# Altium schematic sheet carrier_card.SchDoc: Swarmbot Connectors
size A4; DrawnBy: Thomas Christensen; Revision: 2; SheetNumber: 1; SheetTotal: 3
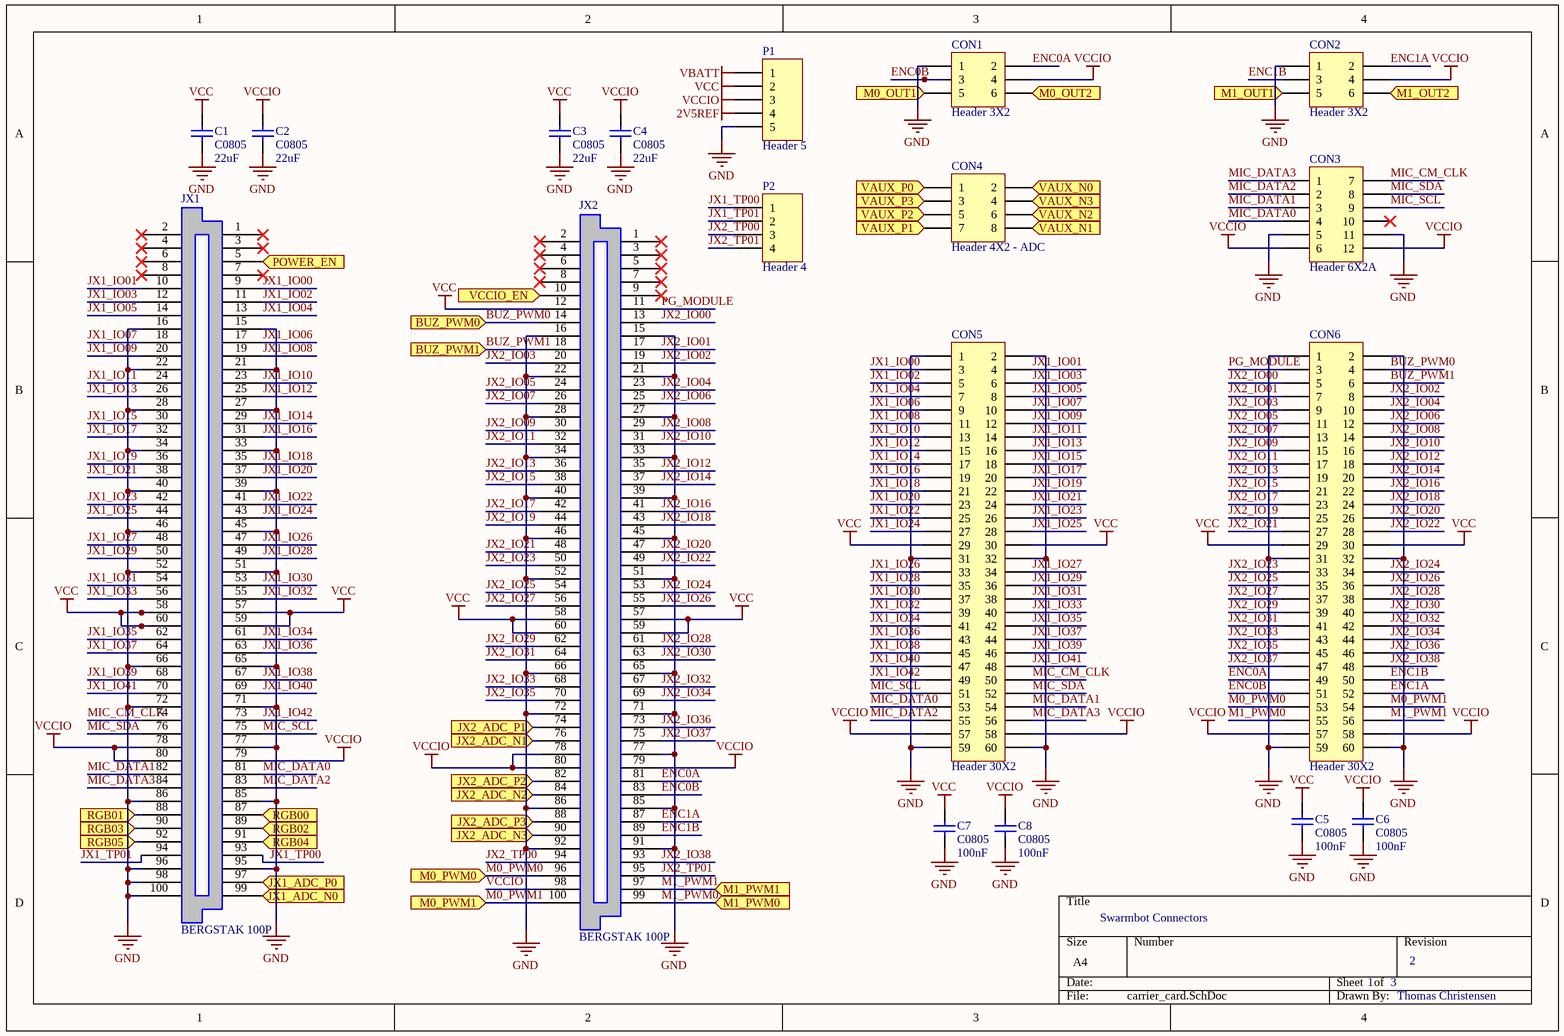
[diagram p0: carrier_card.SchDoc]

## Parts
C1  C0805  value 22uF  [0805]
C2  C0805  value 22uF  [0805]
C3  C0805  value 22uF  [0805]
C4  C0805  value 22uF  [0805]
C5  C0805  value 100nF  [0805]
C6  C0805  value 100nF  [0805]
C7  C0805  value 100nF  [0805]
C8  C0805  value 100nF  [0805]
CON1  Header 3X2  [HDR2X3]
CON2  Header 3X2  [HDR2X3]
CON3  Header 6X2A  [HDR2X6_CEN]
CON4  Header 4X2 - ADC  [HDR2X4]
CON5  Header 30X2  [HDR2X30]
CON6  Header 30X2  [HDR2X30]
JX1  BERGSTAK 100P  [FCI_BERGSTAK_100P]
JX2  BERGSTAK 100P  [FCI_BERGSTAK_100P]
P1  Header 5  [HDR1X5]
P2  Header 4  [HDR1X4]

## Ports
BUZ_PWM0, BUZ_PWM1, JX1_ADC_N0, JX1_ADC_P0, JX2_ADC_N1, JX2_ADC_N2, JX2_ADC_N3, JX2_ADC_P1, JX2_ADC_P2, JX2_ADC_P3, M0_OUT1, M0_OUT2, M0_PWM0, M0_PWM1, M1_OUT1, M1_OUT2, M1_PWM0, M1_PWM1, POWER_EN, RGB00, RGB01, RGB02, RGB03, RGB04, RGB05, VAUX_N0, VAUX_N1, VAUX_N2, VAUX_N3, VAUX_P0, VAUX_P1, VAUX_P2, VAUX_P3, VCCIO_EN

## Nets
2V5REF: P1.4
GND: C1.1 C2.1 C3.1 C4.1 C5.1 C6.1 C7.1 C8.1 CON1.1 CON2.1 CON3.5 CON3.11 CON5.1 CON5.2 CON5.31 CON5.32 CON5.59 CON5.60 CON6.1 CON6.2 CON6.31 CON6.32 CON6.59 CON6.60 JX1.15 JX1.16 JX1.21 JX1.22 JX1.27 JX1.28 JX1.33 JX1.34 JX1.39 JX1.40 JX1.45 JX1.46 JX1.51 JX1.52 JX1.65 JX1.66 JX1.71 JX1.72 JX1.77 JX1.85 JX1.86 JX1.95 JX1.96 JX1.98 JX1.100 JX2.15 JX2.16 JX2.21 JX2.22 JX2.27 JX2.28 JX2.33 JX2.34 JX2.39 JX2.40 JX2.45 JX2.46 JX2.51 JX2.52 JX2.65 JX2.66 JX2.71 JX2.72 JX2.77 JX2.85 JX2.86 JX2.91 JX2.92 P1.5
VBATT: P1.1
VCC: C1.2 C3.2 C5.2 C7.2 CON5.29 CON5.30 CON6.29 CON6.30 JX1.57 JX1.58 JX1.59 JX1.60 JX2.12 JX2.57 JX2.58 JX2.59 JX2.60 P1.2
VCCIO: C2.2 C4.2 C6.2 C8.2 CON1.4 CON2.4 CON3.6 CON3.12 CON5.57 CON5.58 CON6.57 CON6.58 JX1.78 JX1.79 JX1.80 JX2.78 JX2.79 JX2.80 JX2.98 P1.3
BUZ_PWM0: CON6.4 JX2.14 ; port BUZ_PWM0
BUZ_PWM1: CON6.6 JX2.18 ; port BUZ_PWM1
ENC0A: CON1.2 CON6.49 JX2.81
ENC0B: CON1.3 CON6.51 JX2.83
ENC1A: CON2.2 CON6.52 JX2.87
ENC1B: CON2.3 CON6.50 JX2.89
JX1_ADC_N0: JX1.99 ; port JX1_ADC_N0
JX1_ADC_P0: JX1.97 ; port JX1_ADC_P0
JX1_IO00: CON5.3 JX1.9
JX1_IO01: CON5.4 JX1.10
JX1_IO02: CON5.5 JX1.11
JX1_IO03: CON5.6 JX1.12
JX1_IO04: CON5.7 JX1.13
JX1_IO05: CON5.8 JX1.14
JX1_IO06: CON5.9 JX1.17
JX1_IO07: CON5.10 JX1.18
JX1_IO08: CON5.11 JX1.19
JX1_IO09: CON5.12 JX1.20
JX1_IO10: CON5.13 JX1.23
JX1_IO11: CON5.14 JX1.24
JX1_IO12: CON5.15 JX1.25
JX1_IO13: CON5.16 JX1.26
JX1_IO14: CON5.17 JX1.29
JX1_IO15: CON5.18 JX1.30
JX1_IO16: CON5.19 JX1.31
JX1_IO17: CON5.20 JX1.32
JX1_IO18: CON5.21 JX1.35
JX1_IO19: CON5.22 JX1.36
JX1_IO20: CON5.23 JX1.37
JX1_IO21: CON5.24 JX1.38
JX1_IO22: CON5.25 JX1.41
JX1_IO23: CON5.26 JX1.42
JX1_IO24: CON5.27 JX1.43
JX1_IO25: CON5.28 JX1.44
JX1_IO26: CON5.33 JX1.47
JX1_IO27: CON5.34 JX1.48
JX1_IO28: CON5.35 JX1.49
JX1_IO29: CON5.36 JX1.50
JX1_IO30: CON5.37 JX1.53
JX1_IO31: CON5.38 JX1.54
JX1_IO32: CON5.39 JX1.55
JX1_IO33: CON5.40 JX1.56
JX1_IO34: CON5.41 JX1.61
JX1_IO35: CON5.42 JX1.62
JX1_IO36: CON5.43 JX1.63
JX1_IO37: CON5.44 JX1.64
JX1_IO38: CON5.45 JX1.67
JX1_IO39: CON5.46 JX1.68
JX1_IO40: CON5.47 JX1.69
JX1_IO41: CON5.48 JX1.70
JX1_IO42: CON5.49 JX1.73
JX1_TP00: JX1.93 P2.1
JX1_TP01: JX1.94 P2.2
JX2_ADC_N1: JX2.76 ; port JX2_ADC_N1
JX2_ADC_N2: JX2.84 ; port JX2_ADC_N2
JX2_ADC_N3: JX2.90 ; port JX2_ADC_N3
JX2_ADC_P1: JX2.74 ; port JX2_ADC_P1
JX2_ADC_P2: JX2.82 ; port JX2_ADC_P2
JX2_ADC_P3: JX2.88 ; port JX2_ADC_P3
JX2_IO00: CON6.5 JX2.13
JX2_IO01: CON6.7 JX2.17
JX2_IO02: CON6.8 JX2.19
JX2_IO03: CON6.9 JX2.20
JX2_IO04: CON6.10 JX2.23
JX2_IO05: CON6.11 JX2.24
JX2_IO06: CON6.12 JX2.25
JX2_IO07: CON6.13 JX2.26
JX2_IO08: CON6.14 JX2.29
JX2_IO09: CON6.15 JX2.30
JX2_IO10: CON6.16 JX2.31
JX2_IO11: CON6.17 JX2.32
JX2_IO12: CON6.18 JX2.35
JX2_IO13: CON6.19 JX2.36
JX2_IO14: CON6.20 JX2.37
JX2_IO15: CON6.21 JX2.38
JX2_IO16: CON6.22 JX2.41
JX2_IO17: CON6.23 JX2.42
JX2_IO18: CON6.24 JX2.43
JX2_IO19: CON6.25 JX2.44
JX2_IO20: CON6.26 JX2.47
JX2_IO21: CON6.27 JX2.48
JX2_IO22: CON6.28 JX2.49
JX2_IO23: CON6.33 JX2.50
JX2_IO24: CON6.34 JX2.53
JX2_IO25: CON6.35 JX2.54
JX2_IO26: CON6.36 JX2.55
JX2_IO27: CON6.37 JX2.56
JX2_IO28: CON6.38 JX2.61
JX2_IO29: CON6.39 JX2.62
JX2_IO30: CON6.40 JX2.63
JX2_IO31: CON6.41 JX2.64
JX2_IO32: CON6.42 JX2.67
JX2_IO33: CON6.43 JX2.68
JX2_IO34: CON6.44 JX2.69
JX2_IO35: CON6.45 JX2.70
JX2_IO36: CON6.46 JX2.73
JX2_IO37: CON6.47 JX2.75
JX2_IO38: CON6.48 JX2.93
JX2_TP00: JX2.94 P2.3
JX2_TP01: JX2.95 P2.4
M0_OUT1: CON1.5 ; port M0_OUT1
M0_OUT2: CON1.6 ; port M0_OUT2
M0_PWM0: CON6.53 JX2.96 ; port M0_PWM0
M0_PWM1: CON6.54 JX2.100 ; port M0_PWM1
M1_OUT1: CON2.5 ; port M1_OUT1
M1_OUT2: CON2.6 ; port M1_OUT2
M1_PWM0: CON6.55 JX2.99 ; port M1_PWM0
M1_PWM1: CON6.56 JX2.97 ; port M1_PWM1
MIC_CM_CLK: CON3.7 CON5.50 JX1.74
MIC_DATA0: CON3.4 CON5.53 JX1.81
MIC_DATA1: CON3.3 CON5.54 JX1.82
MIC_DATA2: CON3.2 CON5.55 JX1.83
MIC_DATA3: CON3.1 CON5.56 JX1.84
MIC_SCL: CON3.9 CON5.51 JX1.75
MIC_SDA: CON3.8 CON5.52 JX1.76
PG_MODULE: CON6.3 JX2.11
POWER_EN: JX1.5 ; port POWER_EN
RGB00: JX1.87 ; port RGB00
RGB01: JX1.88 ; port RGB01
RGB02: JX1.89 ; port RGB02
RGB03: JX1.90 ; port RGB03
RGB04: JX1.91 ; port RGB04
RGB05: JX1.92 ; port RGB05
VAUX_N0: CON4.2 ; port VAUX_N0
VAUX_N1: CON4.8 ; port VAUX_N1
VAUX_N2: CON4.6 ; port VAUX_N2
VAUX_N3: CON4.4 ; port VAUX_N3
VAUX_P0: CON4.1 ; port VAUX_P0
VAUX_P1: CON4.7 ; port VAUX_P1
VAUX_P2: CON4.5 ; port VAUX_P2
VAUX_P3: CON4.3 ; port VAUX_P3
VCCIO_EN: JX2.10 ; port VCCIO_EN

Not connected (* = marked no-connect by the designer): CON3 10*; JX1 1* 2* 3* 4* 6* 7* 8*; JX2 1* 2* 3* 4* 5* 6* 7* 8* 9*

## Library data of the parts
C1-C8 = C0805: Ceramic Chip Capacitor - Standard; Note: Footprint corresponds to dimensions for bulk cassette packaging. This case size has tightened tolerances.; Published: 17-Jul-2002; LatestRevisionDate: 19-Mar-2004; LatestRevisionNote: Silkscreen size reduced.; DatasheetDocument: Mar-2001; PackageDocument: Mar-2001; PackageReference: 0805; Publisher: Altium Limited; Code_JEITA: 0805; Code_IPC: 2012[0805]; ComponentLink1Description: Manufacturer Link; ComponentLink1URL: http://www.kemet.com/; ComponentLink2Description: Datasheet; ComponentLink2URL: http://www.kemet.com/kemet/web/homepage/kechome.nsf/vapubfilesname/F3102TA.pdf/$file/F3102TA.pdf
CON1 CON2 = Header 3X2: Header, 3-Pin, Dual row; LatestRevisionDate: 17-Jul-2002; LatestRevisionNote: Re-released for DXP Platform.; Publisher: Altium Limited
CON3 = Header 6X2A: Header, 6-Pin, Dual row; LatestRevisionDate: 17-Jul-2002; LatestRevisionNote: Re-released for DXP Platform.; Publisher: Altium Limited
CON4 = Header 4X2: Header, 4-Pin, Dual row; LatestRevisionDate: 17-Jul-2002; LatestRevisionNote: Re-released for DXP Platform.; Publisher: Altium Limited
CON5 CON6 = Header 30X2: Header, 30-Pin, Dual row; LatestRevisionDate: 17-Jul-2002; LatestRevisionNote: Re-released for DXP Platform.; Publisher: Altium Limited
JX1 JX2 = BERGSTAK 100P: 100p connector, BERGSTAK
P1 = Header 5: Header, 5-Pin; LatestRevisionDate: 17-Jul-2002; LatestRevisionNote: Re-released for DXP Platform.; Publisher: Altium Limited
P2 = Header 4: Header, 4-Pin; LatestRevisionDate: 17-Jul-2002; LatestRevisionNote: Re-released for DXP Platform.; Publisher: Altium Limited